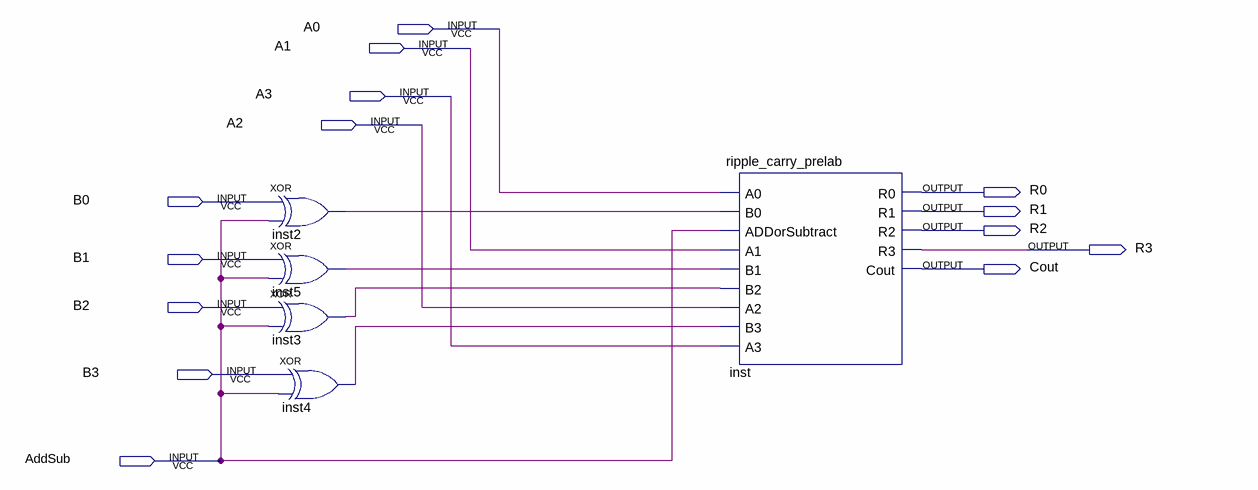
[diagram p0: schematic sheet]
// Quartus schematic adder_with_overflow.bdf as structural Verilog: 5 symbols, 14 pins
module adder_with_overflow (
  input  A0,
  input  A1,
  input  A3,
  input  A2,
  input  B0,
  input  B1,
  input  B2,
  input  B3,
  input  AddSub,
  output R0,
  output R1,
  output R2,
  output R3,
  output Cout
);

  wire inst2_out, inst3_out, inst4_out, inst5_out;

  xor inst2 (inst2_out, B0, AddSub);
  xor inst5 (inst5_out, B1, AddSub);
  xor inst3 (inst3_out, B2, AddSub);
  xor inst4 (inst4_out, B3, AddSub);
  ripple_carry_prelab inst (
    .A0(A0), .B0(inst2_out), .ADDorSubtract(AddSub), .A1(A1), .B1(inst5_out), .B2(inst3_out), .A2(A2),
    .B3(inst4_out), .A3(A3), .R0(R0), .R1(R1), .R2(R2), .R3(R3), .Cout(Cout));
endmodule
